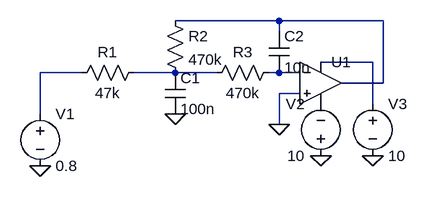
[diagram p0: schematic Circuito1.asc]
Circuito1.asc, the LTspice schematic file:
Version 4
SHEET 1 880 680
WIRE 320 48 160 48
WIRE 480 48 320 48
WIRE 320 64 320 48
WIRE 464 112 384 112
WIRE 16 128 -48 128
WIRE 160 128 96 128
WIRE 224 128 160 128
WIRE 320 128 304 128
WIRE 352 128 320 128
WIRE 480 144 480 48
WIRE 480 144 416 144
WIRE 352 160 320 160
WIRE 464 176 464 112
WIRE -48 192 -48 128
WIRE 320 208 320 160
FLAG -48 272 0
FLAG 160 192 0
FLAG 320 208 0
FLAG 384 256 0
FLAG 464 256 0
SYMBOL voltage -48 176 R0
WINDOW 123 0 0 Left 0
WINDOW 39 0 0 Left 0
SYMATTR InstName V1
SYMATTR Value 0.8
SYMBOL res 0 144 R270
WINDOW 0 32 56 VTop 2
WINDOW 3 0 56 VBottom 2
SYMATTR InstName R1
SYMATTR Value 47k
SYMBOL res 144 32 R0
SYMATTR InstName R2
SYMATTR Value 470k
SYMBOL res 320 112 R90
WINDOW 0 0 56 VBottom 2
WINDOW 3 32 56 VTop 2
SYMATTR InstName R3
SYMATTR Value 470k
SYMBOL cap 144 128 R0
SYMATTR InstName C1
SYMATTR Value 100n
SYMBOL OpAmps\\UniversalOpAmp 384 144 R0
SYMATTR InstName U1
SYMBOL cap 304 64 R0
SYMATTR InstName C2
SYMATTR Value 10n
SYMBOL voltage 384 272 R180
WINDOW 0 24 96 Left 2
WINDOW 3 24 16 Left 2
WINDOW 123 0 0 Left 0
WINDOW 39 0 0 Left 0
SYMATTR InstName V2
SYMATTR Value 10
SYMBOL voltage 464 160 R0
WINDOW 123 0 0 Left 0
WINDOW 39 0 0 Left 0
SYMATTR InstName V3
SYMATTR Value 10

The netlist it stands for:
* Circuito1.asc
V1 N003 0 0.8
R1 N003 N004 47k
R2 N001 N004 470k
R3 N005 N004 470k
C1 N004 0 100n
XU1 0 N005 N002 P001 N001 level1 Avol=1Meg GBW=10Meg Vos=0 En=0 Enk=0 In=0 Ink=0 Rin=500Meg  ; pins In+ In- V+ V- OUT
C2 N001 N005 10n
V2 0 P001 10
V3 N002 0 10
.lib UniversalOpAmp1.lib
.backanno
.end